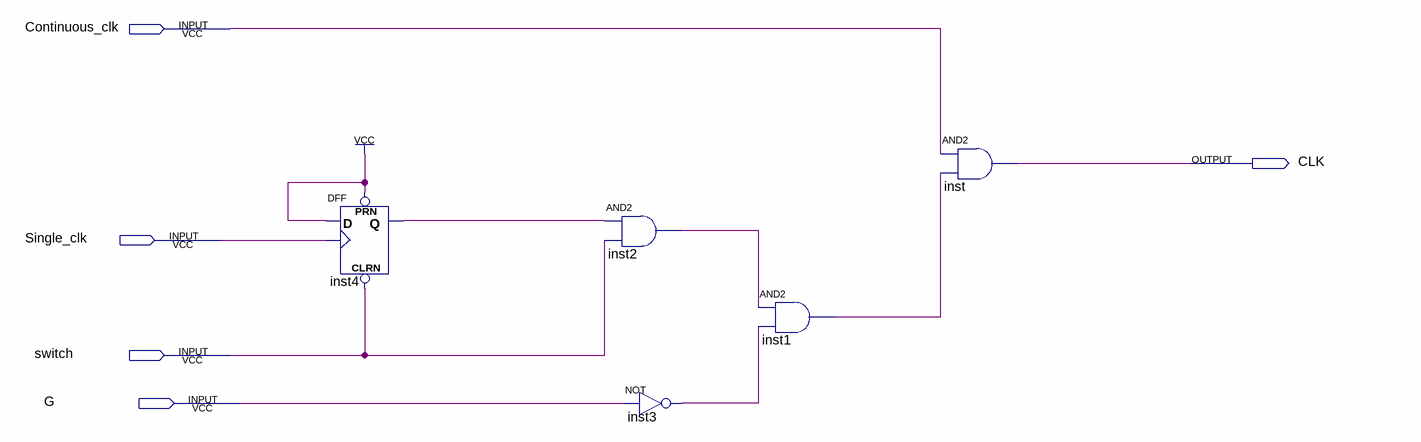
[diagram p0: schematic sheet]
// Quartus schematic begin_stop.bdf as structural Verilog: 5 symbols, 5 pins
module begin_stop (
  input  Continuous_clk,
  input  Single_clk,
  input  switch,
  input  G,
  output CLK
);

  wire inst1_out, inst2_out, inst3_out, inst4_q;

  DFF inst4 (.CLRN(switch), .CLK(Single_clk), .D(1'b1), .PRN(1'b1), .Q(inst4_q));
  and inst2 (inst2_out, inst4_q, switch);
  not inst3 (inst3_out, G);
  and inst1 (inst1_out, inst2_out, inst3_out);
  and inst (CLK, Continuous_clk, inst1_out);
endmodule
